# Altium schematic sheet STM32F103RCT6MinSys.SchDoc
size A4
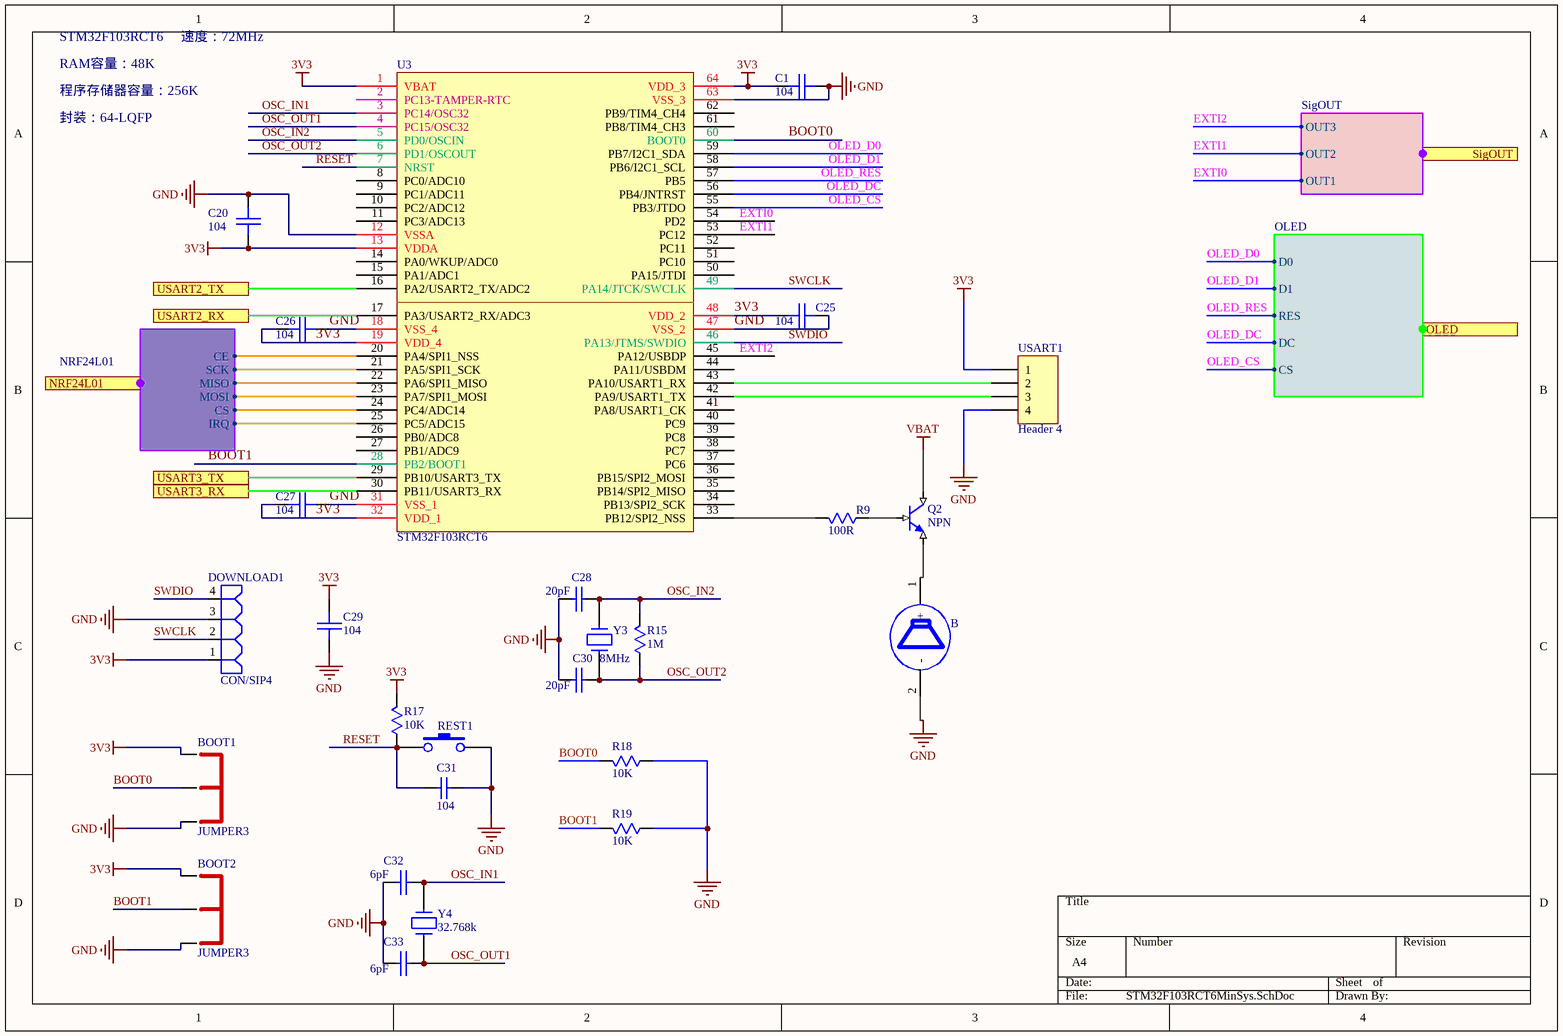
[diagram p0: STM32F103RCT6MinSys.SchDoc]

## Parts
B  BEEP  [BEEP]  (value not drawn)
BOOT1  JUMPER3  [Jumper3]
BOOT2  JUMPER3  [Jumper3]
C1  104  [C0603]
C20  104  [C0603]
C25  104  [C0603]
C26  104  [C0603]
C27  104  [C0603]
C28  20pF  [LC-0603_C]
C29  104  [C0603]
C30  20pF  [LC-0603_C]
C31  104  [LC-0603_C]
C32  6pF  [LC-0603_C]
C33  6pF  [LC-0603_C]
DOWNLOAD1  CON/SIP4  [HDR1X4]
Q2  NPN  [SOT23-3]
R9  100R  [R0603]
R15  1M  [LC-0603_R]
R17  10K  [R0603]
R18  10K  [R0603]
R19  10K  [R0603]
REST1  (no value)  [KEY-K2]
U3  STM32F103RCT6  [LC-LQFP-64_10x10x05P]
USART1  Header 4  [HDR1X4]
Y3  8MHz  [XTAL-49/S_N]
Y4  32.768k  [XTAL_2X6 卧式]

## Ports
NRF24L01 (harness NRF24L01), OLED (harness OLED), SigOUT (harness SigOUT), USART2_RX, USART2_TX, USART3_RX, USART3_TX

## Harnesses
NRF24L01: CE, SCK, MISO, MOSI, CS, IRQ
SigOUT: OUT1, OUT2, OUT3
OLED: D0, D1, RES, DC, CS

## Nets
3V3: BOOT1.1 BOOT2.1 C1.1 C20.2 C25.1 C26.1 C27.1 C29.1 DOWNLOAD1.1 R17.2 U3.1(VBAT) U3.13(VDDA) U3.19(VDD_4) U3.32(VDD_1) U3.48(VDD_2) U3.64(VDD_3) USART1.1
GND: B.2(-) BOOT1.3 BOOT2.3 C1.2 C20.1 C25.2 C26.2 C27.2 C28.1 C29.2 C30.1 C31.1 C32.1 C33.1 DOWNLOAD1.3 R18.1 R19.1 REST1.2 U3.12(VSSA) U3.18(VSS_4) U3.31(VSS_1) U3.47(VSS_2) U3.63(VSS_3) USART1.4
VBAT: Q2.3(C)
BOOT0: BOOT1.2 R18.2 U3.60(BOOT0)
BOOT1: BOOT2.2 R19.2 U3.28(PB2/BOOT1)
EXTI0: U3.54(PD2) ; port SigOUT.OUT1
EXTI1: U3.53(PC12) ; port SigOUT.OUT2
EXTI2: U3.45(PA12/USBDP) ; port SigOUT.OUT3
OLED_CS: U3.55(PB3/JTDO) ; port OLED.CS
OLED_D0: U3.59(PB7/I2C1_SDA) ; port OLED.D0
OLED_D1: U3.58(PB6/I2C1_SCL) ; port OLED.D1
OLED_DC: U3.56(PB4/JNTRST) ; port OLED.DC
OLED_RES: U3.57(PB5) ; port OLED.RES
OSC_IN1: C32.2 U3.3(PC14/OSC32) Y4.2
OSC_IN2: C28.2 R15.2 U3.5(PD0/OSCIN) Y3.1
OSC_OUT1: C33.2 U3.4(PC15/OSC32) Y4.1
OSC_OUT2: C30.2 R15.1 U3.6(PD1/OSCOUT) Y3.2
RESET: C31.2 R17.1 REST1.1 U3.7(NRST)
SWCLK: DOWNLOAD1.2 U3.49(PA14/JTCK/SWCLK)
SWDIO: DOWNLOAD1.4 U3.46(PA13/JTMS/SWDIO)
USART2_RX: U3.17(PA3/USART2_RX/ADC3) ; port USART2_RX
USART2_TX: U3.16(PA2/USART2_TX/ADC2) ; port USART2_TX
USART3_RX: U3.30(PB11/USART3_RX) ; port USART3_RX
USART3_TX: U3.29(PB10/USART3_TX) ; port USART3_TX
NetB_1: B.1(+) Q2.1(E)
NetQ2_2: Q2.2(B) R9.1
NetR9_2: R9.2 U3.33(PB12/SPI2_NSS)
NetU3_20: U3.20(PA4/SPI1_NSS) ; port NRF24L01.CE
NetU3_21: U3.21(PA5/SPI1_SCK) ; port NRF24L01.SCK
NetU3_22: U3.22(PA6/SPI1_MISO) ; port NRF24L01.MISO
NetU3_23: U3.23(PA7/SPI1_MOSI) ; port NRF24L01.MOSI
NetU3_24: U3.24(PC4/ADC14) ; port NRF24L01.CS
NetU3_25: U3.25(PC5/ADC15) ; port NRF24L01.IRQ
NetU3_42: U3.42(PA9/USART1_TX) USART1.3
NetU3_43: U3.43(PA10/USART1_RX) USART1.2

Not connected (* = marked no-connect by the designer): U3 2(PC13-TAMPER-RTC) 8(PC0/ADC10) 9(PC1/ADC11) 10(PC2/ADC12) 11(PC3/ADC13) 14(PA0/WKUP/ADC0) 15(PA1/ADC1) 26(PB0/ADC8) 27(PB1/ADC9) 34(PB13/SPI2_SCK) 35(PB14/SPI2_MISO) 36(PB15/SPI2_MOSI) 37(PC6) 38(PC7) 39(PC8) 40(PC9) 41(PA8/USART1_CK) 44(PA11/USBDM) 50(PA15/JTDI) 51(PC10) 52(PC11) 61(PB8/TIM4_CH3) 62(PB9/TIM4_CH4)

## Notes on the sheet
- STM32F103RCT6
- 速度：72MHz
- 程序存储器容量：256K
- RAM容量：48K
- 封装：64-LQFP

## Library data of the parts
B = 蜂鸣器
BOOT1 BOOT2 = JUMPER3: Jumper
C1 C20 C25-C27 C29 = CAP
C28 C30 = CAP: CAP CHIP 20P 50V(+-5% C0G 0603); Value: 20pF
C31 = CAP: GRM39 X7R102K50PT; Value: 100pF; Published: 8-Jun-2000; Revision: July-2002: Re-released for DXP Platform.; Publisher: Altium Limited; REF: GRM39 X7R102K50PT
C32 C33 = CAP: CAP CHIP 20P 50V(+-5% C0G 0603); Value: 20pF
Q2 = NPN: triode
R9 R15 R17-R19 = RES
REST1 = SW-PB
U3 = STM32F103RBT6
USART1 = Header 4: Header, 4-Pin; LatestRevisionDate: 17-Jul-2002; LatestRevisionNote: Re-released for DXP Platform.; Publisher: Altium Limited
Y3 Y4 = CRYSTAL: Crystal 8MHz PLUG; Value: 8MHz